# EAGLE design TEMP(NC_I2C_V1) (EAGLE 6.5.0)
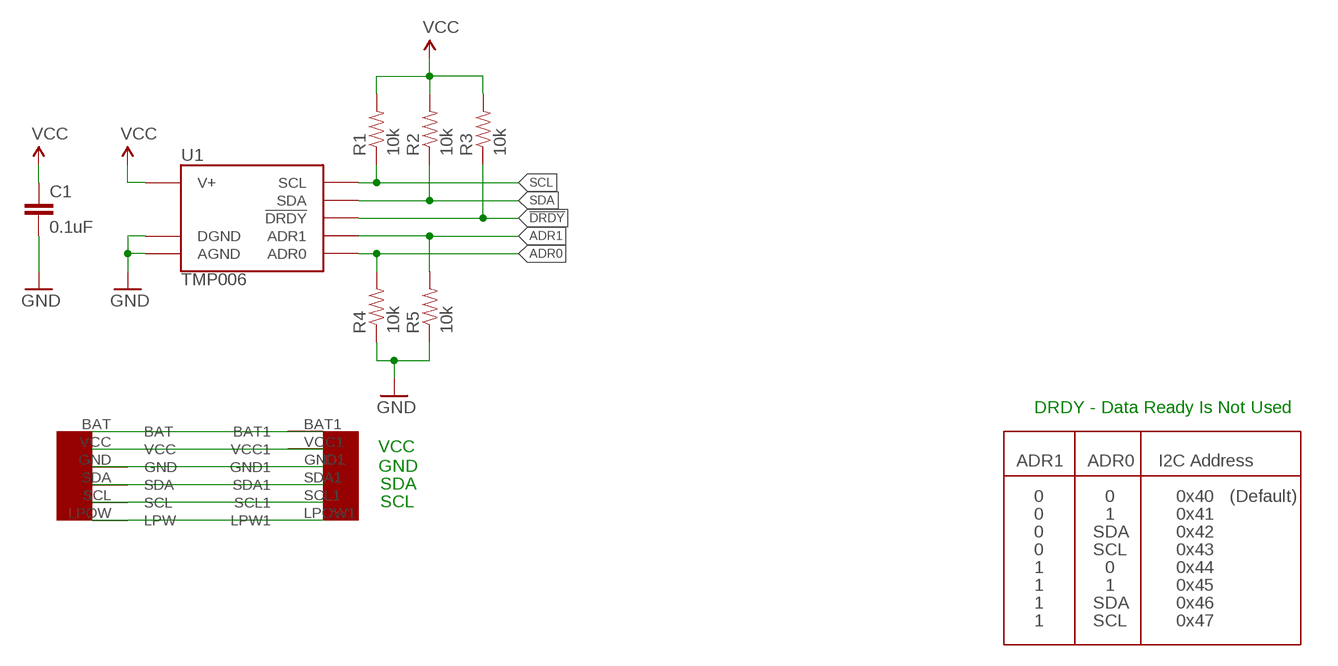
[diagram p0: schematic, sheet 1]

## Parts
C1  0.1uF  CAP0603-CAP  [0603-CAP]
R1  10k  RESISTOR0603-RES  [0603-RES]
R2  10k  RESISTOR0603-RES  [0603-RES]
R3  10k  RESISTOR0603-RES  [0603-RES]
R4  10k  RESISTOR0603-RES  [0603-RES]
R5  10k  RESISTOR0603-RES  [0603-RES]
U1  TMP006  [BGA8DS]
U$1  EASYI2C6PINHEADER  [EASYI2C6PINHEADER]

## Nets
!DRDY: R3.1 U1.C2(!DRDY)
ADR0: R4.2 U1.C1(ADR0)
ADR1: R5.2 U1.B1(ADR1)
GND: C1.2 R4.1 R5.1 U1.A1(DGND) U1.A2(AGND) U$1.GND U$1.GND1
N$1: U$1.BAT U$1.BAT1
N$2: U$1.LPOW1(LPW1) U$1.LPOW(LPW)
SCL: R1.1 U1.B3(SCL) U$1.SCL U$1.SCL1
SDA: R2.1 U1.C3(SDA) U$1.SDA U$1.SDA1
VCC: C1.1 R1.2 R2.2 R3.2 U1.A3(V+) U$1.VCC U$1.VCC1

## Notes on the sheet
- DRDY - Data Ready Is Not Used
- VCC
- ADR1 | ADR0 | I2C Address
- GND
- SDA
- 0 | 0 | 0x40 | (Default)
- SCL
- 0 | 1 | 0x41
- 0 | SDA | 0x42
- 0 | SCL | 0x43
- 1 | 0 | 0x44
- 1 | 1 | 0x45
- 1 | SDA | 0x46
- 1 | SCL | 0x47

## Library data of the parts
C1 = SparkFun-Capacitors:CAP: Capacitor Standard 0603 ceramic capacitor, and 0.1" leaded capacitor.
R1-R5 = SparkFun-Resistors:RESISTOR: Resistor Basic schematic elements and footprints for 0603, 1206, and PTH resistors.
U1 = SparkFun-DigitalIC:TMP006
U$1 = UniqueInteractionsLib:EASYI2C6PINHEADER

## Board
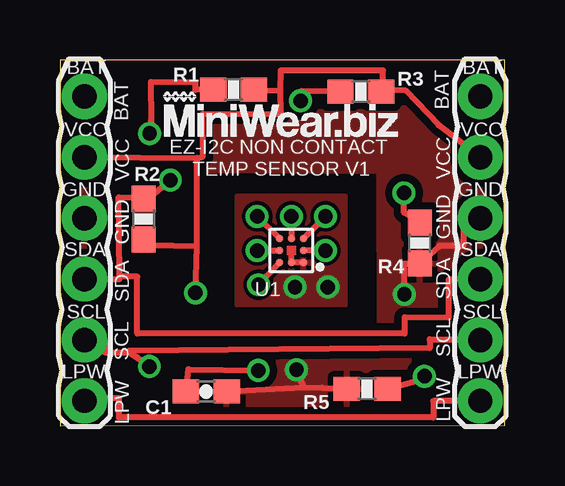
[diagram p1: board, top side]
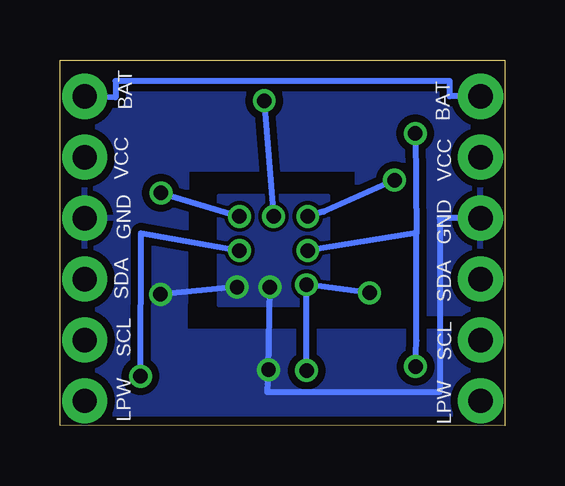
[diagram p2: board, bottom side, seen from below]

Size 18.56 x 15.25 mm. Coordinates in mm from the lower left corner, seen from the top.
Outline: 0,15.24 0,0 18.55,0.01 18.56,15.25 0,15.24
Copper layers (1*16): Top 0.0356mm / dielectric 1.5011mm / Bottom 0.0356mm
Design rules "oshParkPCBDesignRules": minimum track width 6mil, minimum drill 13mil, track to track 6mil, track to pad 6mil, pad to pad 6mil, via to via 6mil, smd to smd 6mil, copper to edge 15mil, drill to drill 6mil, minimum pad ring 7mil, minimum via ring 7mil, stop-mask expansion 3mil, vias tented up to drill 0mil, thermal gap 10mil

### Footprints (pad centres in the part's own frame; a part is rotated, then mirrored left to right if it is on the bottom)
0603-CAP = smd 1.1 x 1: 1 -0.85,0; 2 0.85,0
0603-RES = smd 1.1 x 1: 1 -0.85,0; 2 0.85,0
BGA8DS = smd 0.305 x 0.305: A1 0.5,-0.5; A2 0,-0.5; A3 -0.5,-0.5; B1 0.5,0; B3 -0.5,0; C1 0.5,0.5; C2 0,0.5; C3 -0.5,0.5
EASYI2C6PINHEADER = drill 1.016 pad 1.88: BAT 2.54,13.97; BAT1 19.05,13.97; GND 2.54,8.89; GND1 19.05,8.89; LPOW 2.54,1.27; LPOW1 19.05,1.27; SCL 2.54,3.81; SCL1 19.05,3.81; SDA 2.54,6.35; SDA1 19.05,6.35; VCC 2.54,11.43; VCC1 19.05,11.43

### Placement (x,y rotation side)
C1  6.1,1.42 0 top
R1  7.24,14.01 0 top
R2  3.49,8.61 270 top
R3  12.55,13.92 0 top
R4  15,7.61 90 top
R5  12.81,1.53 0 top
U1  9.65,7.3 0 top
U$1  -1.52,-0.24 0 top
U$2  [LOGO2]  4.22,11.86 0 top

### Tracks (layer width: path | path; a pad name or v marks a point on that pad's centre or on a via)
!DRDY  (via drill 0.6 pad 0.25)
  Top 0.254: R3.1 10.08,13.96 10.05,13.92 v10.04,13.55 | v9.65,8.72 U1.C2
  Bottom 0.254: v10.04,13.55 v9.65,8.72
ADR0  (via drill 0.6 pad 0.25)
  Top 0.254: R4.2 14.35,8.88 v14.35,9.7 | v11.07,8.72 U1.C1
  Bottom 0.254: v14.35,9.7 v11.07,8.72
ADR1  (via drill 0.6 pad 0.25)
  Top 0.254: R5.2 15.09,1.93 v15.2,2.06 | v11.07,7.3 U1.B1
  Bottom 0.254: v15.2,2.06 15.18,8.03 v11.07,7.3
GND  (via drill 0.6 pad 0.25)
  Top 0.254: 10.18,1.6 10.93,1.58 R5.1 | C1.2 10.18,1.6 | 10.18,1.6 v9.86,2.33 | v9.8,5.78 9.8,6.03 | v14.37,5.48 14.37,6.76 R4.1 15.82,7.49 16.82,7.49 16.82,8.65 U$1.GND1 | U1.A1 U1.A2 9.65,7.24
  Bottom 0.254: v9.8,5.78 v9.86,2.33 9.91,1.39 2.72,1.39 2.72,8.65 U$1.GND | v11.17,5.78 v14.37,5.48
  pour Top: 7.36,5.01 7.36,9.59 11.94,9.59 11.94,5.01
  pour Top (isolate 0.305): -0.04,3.92 -0.14,-1.04 19.01,-1.04 18.92,15.07 -0.23,15.07 -0.24,4.67 6.21,4.67 6.18,10.66 13.3,10.61 13.33,3.87
  pour Bottom (isolate 0.305): -0.04,3.92 -0.14,-1.04 19.01,-1.04 18.91,15.16 -0.24,15.16 -0.24,4.67 6.21,4.67 6.14,10.68 13.29,10.7 13.36,3.94
  pour Bottom: 7.36,9.59 11.94,9.59 11.94,5.01 7.36,5.01
N$1
  Bottom 0.254: U$1.BAT 2.3,13.73 2.3,14.37 16.24,14.37 16.24,13.68 U$1.BAT1
N$2
  Top 0.254: U$1.LPOW1 15.57,1.03 15.57,0.34 2.46,0.34 2.46,1.14 1.02,1.14 U$1.LPOW
SCL  (via drill 0.6, 0.6 pad 0.25)
  Top 0.254: R1.1 5.65,14.01 5.65,14.31 3.79,14.33 3.8,12.72 v3.74,12.18 | v8.23,7.3 U1.B3 | 15.42,3.6 15.42,3.57 | U$1.SCL1 15.42,3.57 | 15.42,3.57 15.42,3.23 2.85,3.11 v3.73,2.46 2.89,3.06 1.86,3.06 1.86,3.57 U$1.SCL
  Bottom 0.254: v3.74,12.18 3.69,8.03 | 3.69,8.03 v8.23,7.3 | v3.73,2.46 3.69,3.55 3.69,8.03
SDA  (via drill 0.6 pad 0.25)
  Top 0.254: v4.6,10.23 3.79,9.56 R2.1 3.48,9.5 2.45,9.53 2.48,6.21 | v8.23,8.72 U1.C3 | 2.48,6.21 2.48,6.11 U$1.SDA | 16.2,6.09 16.2,4.5 14.37,4.52 14.37,3.84 3.22,3.84 3.22,6.21 2.48,6.21 | U$1.SDA1 16.2,6.09 | 16.2,6.09 16.48,6.09
  Bottom 0.254: v4.6,10.23 7.57,8.92 v8.23,8.72
VCC  (via drill 0.6 pad 0.25)
  Top 0.254: v5.65,5.54 5.71,7.49 | 5.71,7.49 5.71,11.16 | 5.71,11.16 5.96,11.22 5.95,13 9.21,13.01 9.17,13.96 | v8.28,5.88 U1.A3 | C1.1 5.36,2.35 v8.27,2.29 | R2.2 3.52,7.52 3.75,7.52 5.71,7.49 | R1.2 9.17,13.96 | 9.17,13.96 9.21,14.81 13.47,14.81 13.47,13.82 R3.2 13.43,14.01 14.43,13.96 15.8,12.53 U$1.VCC1 | U$1.VCC 5.71,11.16
  Bottom 0.254: v5.65,5.54 v8.28,5.88 v8.27,2.29

### Text on the board
tNames: EZ-I2C NON CONTACT / TEMP SENSOR V1